# Altium schematic sheet USB-Charger-BMS.SchDoc
size B; SheetNumber: 3; SheetTotal: 15
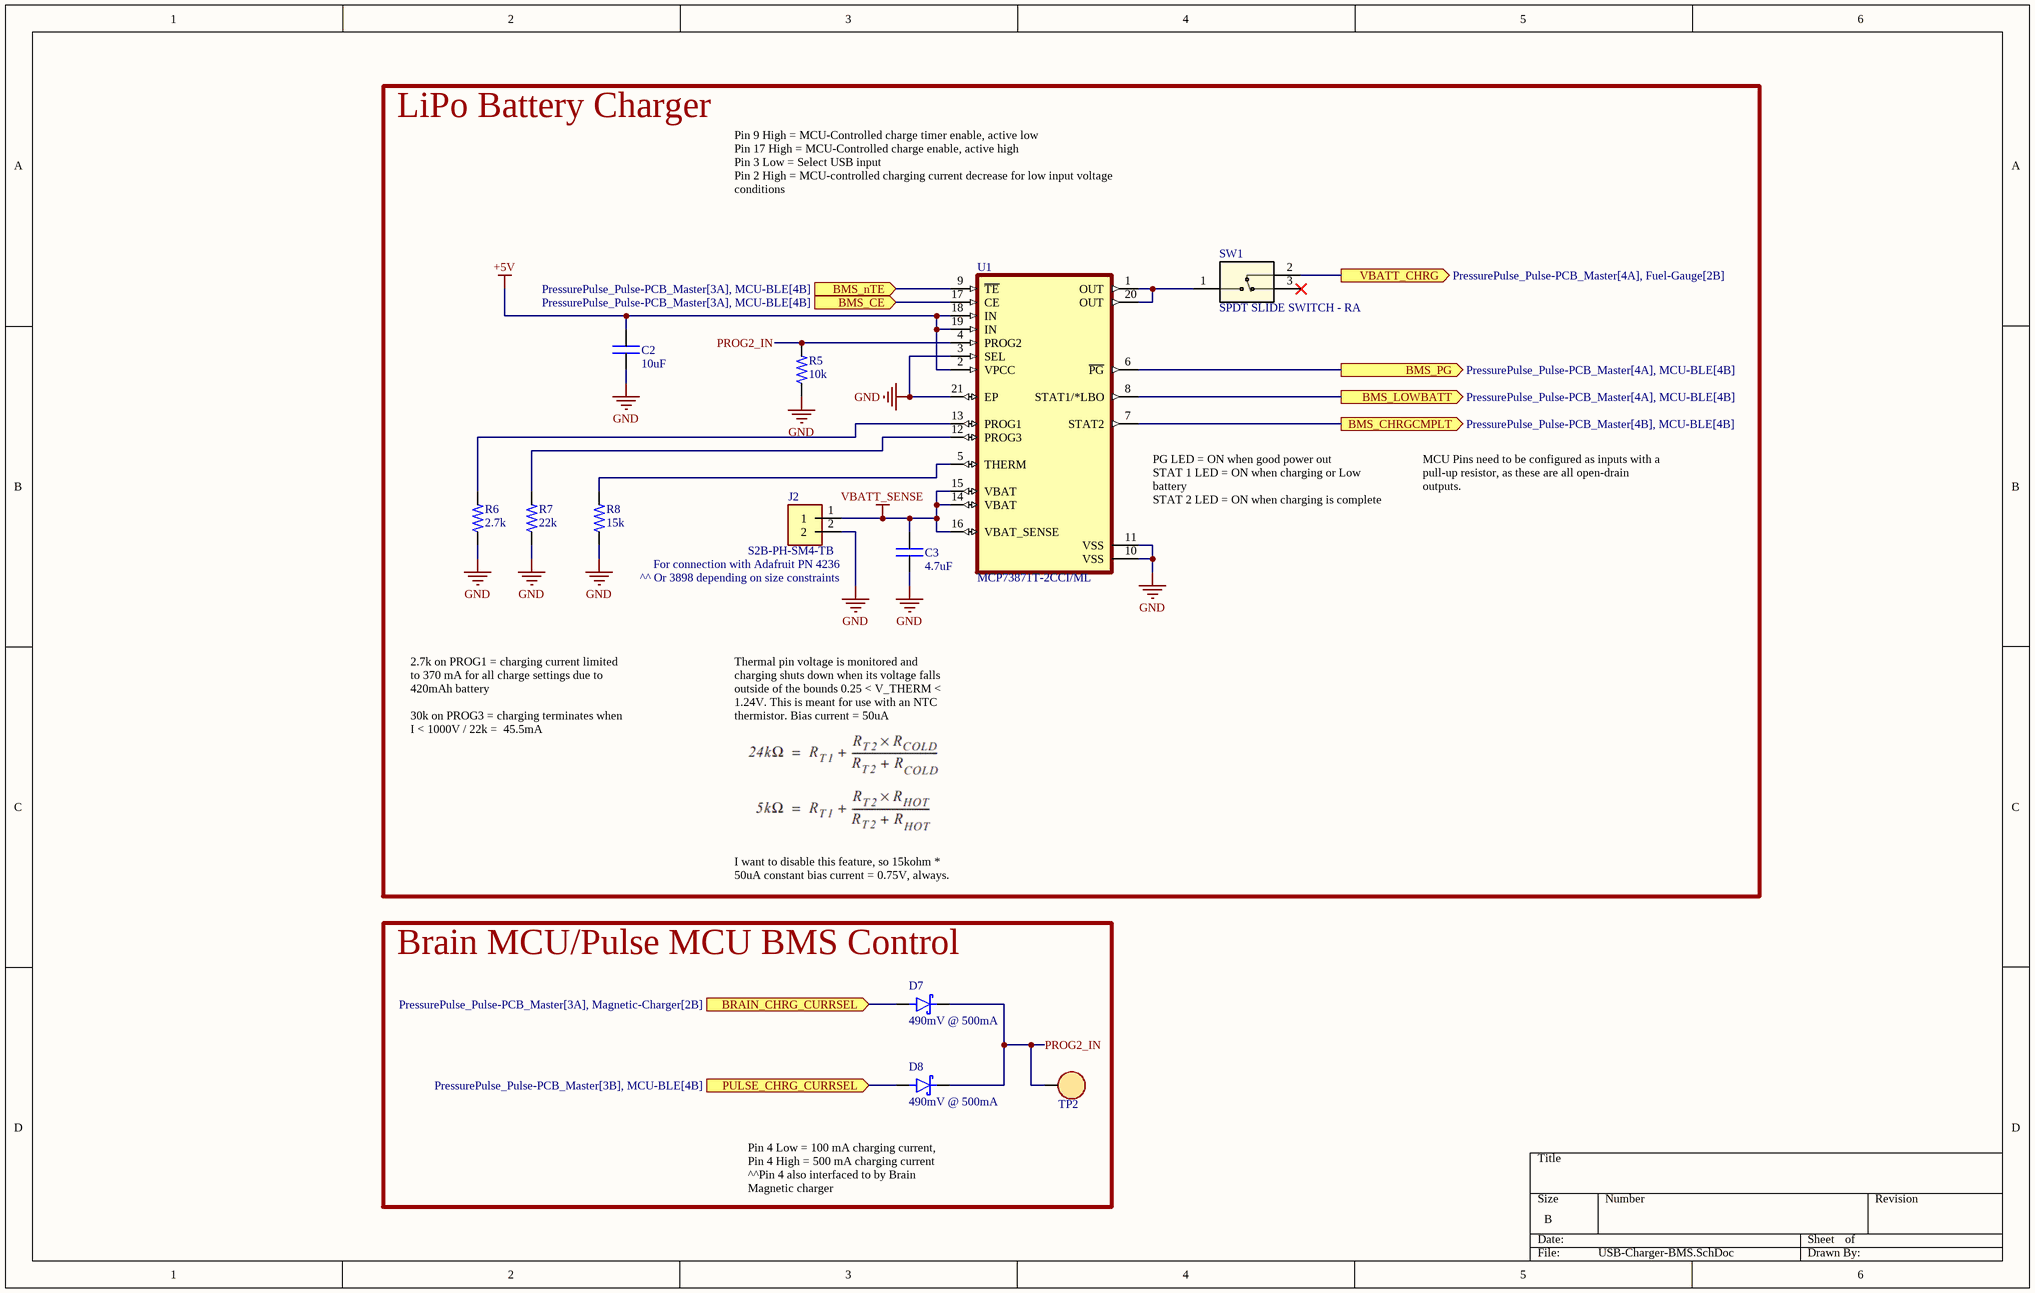
[diagram p0: USB-Charger-BMS.SchDoc]

## Parts
C2  value 10uF  [0402C]  (hidden comment: CAP)
C3  value 4.7uF  [0402C]  (hidden comment: CAP)
D7  490mV @ 500mA  [SOD-523]
D8  490mV @ 500mA  [SOD-523]
J2  S2B-PH-SM4-TB  [JST_PH-2POS-SMT-RA]
R5  value 10k  [0402R]  (hidden comment: RES)
R6  value 2.7k  [0402R]  (hidden comment: RES)
R7  value 22k  [0402R]  (hidden comment: RES)
R8  value 15k  [0402R]  (hidden comment: RES)
SW1  SPDT SLIDE SWITCH - RA  [K3-1290S-J1]
TP2  RH-5019  [TP - RH-5019]  (value not drawn)
U1  MCP73871T-2CCI/ML  [20-VFQFN EXPOSED PAD]

## Blocks framed on the sheet
LiPo Battery Charger: C2 C3 J2 R5-R8 SW1 U1
Brain MCU/Pulse MCU BMS Control: D7 D8 TP2

## Ports
BMS_CE (in, see PressurePulse_Pulse-PCB_Master[3A], MCU-BLE[4B]), BMS_CHRGCMPLT (out, see PressurePulse_Pulse-PCB_Master[4B], MCU-BLE[4B]), BMS_LOWBATT (out, see PressurePulse_Pulse-PCB_Master[4A], MCU-BLE[4B]), BMS_nTE (in, see PressurePulse_Pulse-PCB_Master[3A], MCU-BLE[4B]), BMS_PG (out, see PressurePulse_Pulse-PCB_Master[4A], MCU-BLE[4B]), BRAIN_CHRG_CURRSEL (in, see PressurePulse_Pulse-PCB_Master[3A], Magnetic-Charger[2B]), PULSE_CHRG_CURRSEL (in, see PressurePulse_Pulse-PCB_Master[3B], MCU-BLE[4B]), VBATT_CHRG (out, see PressurePulse_Pulse-PCB_Master[4A], Fuel-Gauge[2B])

## Nets
+5V: C2.2 U1.2(VPCC) U1.18(IN) U1.19(IN)
GND: C2.1 C3.1 J2.2 R5.1 R6.1 R7.1 R8.1 U1.3(SEL) U1.10(VSS) U1.11(VSS) U1.21(EP)
VBATT_SENSE: C3.2 J2.1 U1.14(VBAT) U1.15(VBAT) U1.16(VBAT_SENSE)
BMS_CE: U1.17(CE) ; port BMS_CE
BMS_CHRGCMPLT: U1.7(STAT2) ; port BMS_CHRGCMPLT
BMS_LOWBATT: U1.8(STAT1/*LBO) ; port BMS_LOWBATT
BMS_nTE: U1.9(~{TE}) ; port BMS_nTE
BMS_PG: U1.6(~{PG}) ; port BMS_PG
BRAIN_CHRG_CURRSEL: D7.A ; port BRAIN_CHRG_CURRSEL
PROG2_IN: D7.K D8.K R5.2 TP2.1 U1.4(PROG2)
PULSE_CHRG_CURRSEL: D8.A ; port PULSE_CHRG_CURRSEL
VBATT_CHRG: SW1.2 ; port VBATT_CHRG
NetR6_2: R6.2 U1.13(PROG1)
NetR7_2: R7.2 U1.12(PROG3)
NetR8_2: R8.2 U1.5(THERM)
NetSW1_1: SW1.1 U1.1(OUT) U1.20(OUT)

Not connected (* = marked no-connect by the designer): SW1 3*

## Notes on the sheet
- Pin 9 High = MCU-Controlled charge timer enable, active low
  Pin 17 High = MCU-Controlled charge enable, active high
  Pin 3 Low = Select USB input
  Pin 2 High = MCU-controlled charging current decrease for low input voltage conditions
- (near U1) PG LED = ON when good power out
  STAT 1 LED = ON when charging or Low battery
  STAT 2 LED = ON when charging is complete
- MCU Pins need to be configured as inputs with a pull-up resistor, as these are all open-drain outputs.
- For connection with Adafruit PN 4236
- ^^ Or 3898 depending on size constraints
- 2.7k on PROG1 = charging current limited to 370 mA for all charge settings due to 420mAh battery
  30k on PROG3 = charging terminates when I < 1000V / 22k =  45.5mA
- Thermal pin voltage is monitored and charging shuts down when its voltage falls outside of the bounds 0.25 < V_THERM < 1.24V. This is meant for use with an NTC thermistor. Bias current = 50uA
- I want to disable this feature, so 15kohm * 50uA constant bias current = 0.75V, always.
- Pin 4 Low = 100 mA charging current, Pin 4 High = 500 mA charging current
  ^^Pin 4 also interfaced to by Brain Magnetic charger

## Library data of the parts
C2 C3 = CAP: Capacitor; MFR: *; MFR PN: *; JLCPCB PN: *; Footprint: *
D7 D8 = SCHOTTKY DIODE: MFR: Shikues; MFR PN: MSK4005; Value: MSK4005; JLCPCB PN: C345957
J2 = JST CONN 2POS PH: Connector Header Surface Mount, Right Angle 2 position 0.079 (2.00mm); MFR PN: S2B-PH-SM4-TB(TF)(SN); MFR: JST Sales; Value: S2B-PH-SM4-TB(LF)(SN); Type: SMD; JLCPCB PN: C295747
R5-R8 = RES: Resistor; MFR PN: *; MFR: *; JLCPCB PN: *
SW1 = SPDT SLIDE SWITCH - RA: MFR: Korean Hroparts Elec; Value: K3-1290S-J1; MFR PN: K3-1290S-J1; Type: SMD; JLCPCB PN: C223846
TP2 = TEST POINT: MFR: ronghe; MFR PN: RH-5019; Value: RH-5019; JLCPCB PN: C5199800
U1 = LiPo Batt Charger - Shared load: Charger IC Lithium Ion/Polymer 20-QFN (4x4); MFR: Microchip Technology; MFR PN: MCP73871T-2CCI/ML; Value: MCP73871T-2CCI/ML; JLCPCB PN: C511310